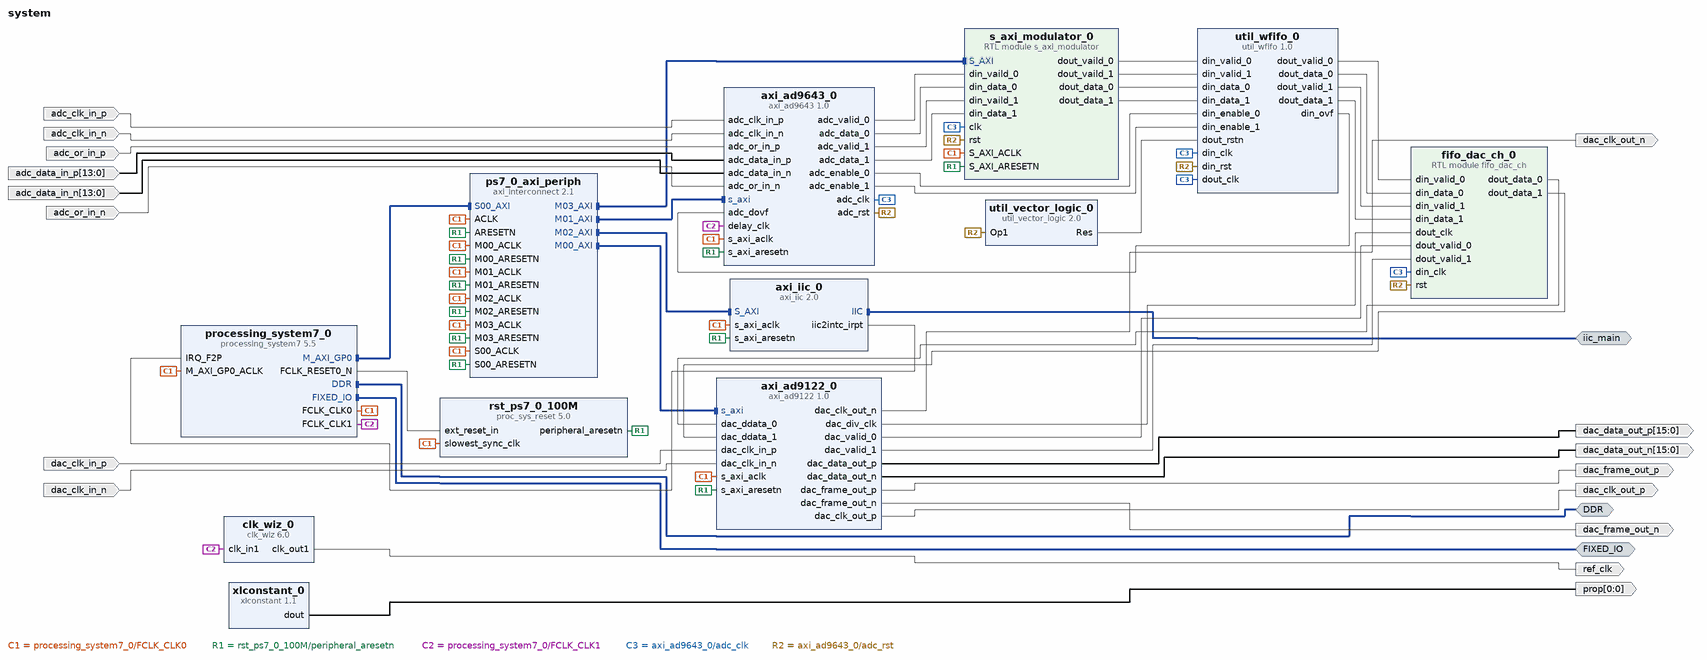
[diagram p0: block diagram of the top level]
# Vivado block design system, xc7z045ffg900-2, Vivado 2019.1
create_bd_design system

create_bd_intf_port -mode Master -vlnv xilinx.com:interface:ddrx_rtl:1.0 DDR
create_bd_intf_port -mode Master -vlnv xilinx.com:display_processing_system7:fixedio_rtl:1.0 FIXED_IO
create_bd_intf_port -mode Master -vlnv xilinx.com:interface:iic_rtl:1.0 iic_main
create_bd_port -dir I adc_clk_in_p
create_bd_port -dir I adc_clk_in_n
create_bd_port -dir I adc_or_in_p
create_bd_port -dir I -from 13 -to 0 adc_data_in_p
create_bd_port -dir I -from 13 -to 0 adc_data_in_n
create_bd_port -dir I adc_or_in_n
create_bd_port -dir O dac_clk_out_n
create_bd_port -dir O -from 15 -to 0 dac_data_out_p
create_bd_port -dir I dac_clk_in_p
create_bd_port -dir O -from 15 -to 0 dac_data_out_n
create_bd_port -dir O dac_frame_out_p
create_bd_port -dir O dac_frame_out_n
create_bd_port -dir O dac_clk_out_p
create_bd_port -dir I dac_clk_in_n
create_bd_port -dir O -type clk ref_clk
set_property -dict {CONFIG.FREQ_HZ 30000000} [get_bd_ports ref_clk]
create_bd_port -dir O -from 0 -to 0 prop

create_bd_cell -type ip -vlnv analog.com:user:axi_ad9122:1.0 axi_ad9122_0
create_bd_cell -type ip -vlnv analog.com:user:axi_ad9643:1.0 axi_ad9643_0
create_bd_cell -type ip -vlnv analog.com:user:util_wfifo:1.0 util_wfifo_0
set_property -dict {CONFIG.DIN_ADDRESS_WIDTH 4 CONFIG.DIN_DATA_WIDTH 16 CONFIG.NUM_OF_CHANNELS 2} [get_bd_cells util_wfifo_0]
create_bd_cell -type ip -vlnv xilinx.com:ip:processing_system7:5.5 processing_system7_0
set_property -dict [list \
  CONFIG.PCW_APU_PERIPHERAL_FREQMHZ 667.000000 \
  CONFIG.PCW_DUAL_PARALLEL_QSPI_DATA_MODE x8 \
  CONFIG.PCW_ENET0_ENET0_IO {MIO 16 .. 27} \
  CONFIG.PCW_ENET0_GRP_MDIO_ENABLE 1 \
  CONFIG.PCW_ENET0_GRP_MDIO_IO {MIO 52 .. 53} \
  CONFIG.PCW_ENET0_PERIPHERAL_ENABLE 1 \
  CONFIG.PCW_ENET0_PERIPHERAL_FREQMHZ {100 Mbps} \
  CONFIG.PCW_ENET0_RESET_ENABLE 1 \
  CONFIG.PCW_ENET0_RESET_IO {MIO 47} \
  CONFIG.PCW_ENET_RESET_ENABLE 1 \
  CONFIG.PCW_ENET_RESET_SELECT {Share reset pin} \
  CONFIG.PCW_EN_CLK1_PORT 1 \
  CONFIG.PCW_FCLK_CLK1_BUF TRUE \
  CONFIG.PCW_FPGA0_PERIPHERAL_FREQMHZ 100 \
  CONFIG.PCW_FPGA1_PERIPHERAL_FREQMHZ 200 \
  CONFIG.PCW_FPGA_FCLK1_ENABLE 1 \
  CONFIG.PCW_GPIO_MIO_GPIO_ENABLE 1 \
  CONFIG.PCW_GPIO_MIO_GPIO_IO MIO \
  CONFIG.PCW_I2C0_GRP_INT_ENABLE 0 \
  CONFIG.PCW_I2C0_I2C0_IO {MIO 50 .. 51} \
  CONFIG.PCW_I2C0_PERIPHERAL_ENABLE 1 \
  CONFIG.PCW_I2C0_RESET_ENABLE 1 \
  CONFIG.PCW_I2C0_RESET_IO {MIO 46} \
  CONFIG.PCW_I2C_PERIPHERAL_FREQMHZ 111.111115 \
  CONFIG.PCW_I2C_RESET_ENABLE 1 \
  CONFIG.PCW_I2C_RESET_SELECT {Share reset pin} \
  CONFIG.PCW_IRQ_F2P_INTR 1 \
  CONFIG.PCW_PRESET_BANK0_VOLTAGE {LVCMOS 1.8V} \
  CONFIG.PCW_PRESET_BANK1_VOLTAGE {LVCMOS 1.8V} \
  CONFIG.PCW_QSPI_GRP_FBCLK_ENABLE 1 \
  CONFIG.PCW_QSPI_GRP_FBCLK_IO {MIO 8} \
  CONFIG.PCW_QSPI_GRP_IO1_ENABLE 1 \
  CONFIG.PCW_QSPI_GRP_IO1_IO {MIO 0 9 .. 13} \
  CONFIG.PCW_QSPI_GRP_SINGLE_SS_ENABLE 0 \
  CONFIG.PCW_QSPI_INTERNAL_HIGHADDRESS 0xFDFFFFFF \
  CONFIG.PCW_QSPI_PERIPHERAL_ENABLE 1 \
  CONFIG.PCW_QSPI_QSPI_IO {MIO 1 .. 6} \
  CONFIG.PCW_SD0_GRP_CD_ENABLE 1 \
  CONFIG.PCW_SD0_GRP_CD_IO {MIO 14} \
  CONFIG.PCW_SD0_GRP_WP_ENABLE 1 \
  CONFIG.PCW_SD0_GRP_WP_IO {MIO 15} \
  CONFIG.PCW_SD0_PERIPHERAL_ENABLE 1 \
  CONFIG.PCW_SD0_SD0_IO {MIO 40 .. 45} \
  CONFIG.PCW_SDIO_PERIPHERAL_FREQMHZ 50 \
  CONFIG.PCW_UART1_PERIPHERAL_ENABLE 1 \
  CONFIG.PCW_UART1_UART1_IO {MIO 48 .. 49} \
  CONFIG.PCW_UART_PERIPHERAL_FREQMHZ 50 \
  CONFIG.PCW_UIPARAM_DDR_FREQ_MHZ 533.333313 \
  CONFIG.PCW_UIPARAM_DDR_PARTNO Custom \
  CONFIG.PCW_USB0_PERIPHERAL_ENABLE 0 \
  CONFIG.PCW_USB_RESET_ENABLE 1 \
  CONFIG.PCW_USE_FABRIC_INTERRUPT 1 \
  CONFIG.preset ZC706 \
] [get_bd_cells processing_system7_0]
# 234 more settings of processing_system7_0 are not shown: defaults, MIO pin electricals, DDR timing, and values the tool derives
create_bd_cell -type ip -vlnv xilinx.com:ip:axi_iic:2.0 axi_iic_0
create_bd_cell -type ip -vlnv xilinx.com:ip:clk_wiz:6.0 clk_wiz_0
set_property -dict [list \
  CONFIG.CLKOUT1_DRIVES BUFG \
  CONFIG.CLKOUT1_JITTER 134.641 \
  CONFIG.CLKOUT1_PHASE_ERROR 82.655 \
  CONFIG.CLKOUT1_REQUESTED_OUT_FREQ 30.000 \
  CONFIG.CLKOUT2_DRIVES BUFG \
  CONFIG.CLKOUT3_DRIVES BUFG \
  CONFIG.CLKOUT4_DRIVES BUFG \
  CONFIG.CLKOUT5_DRIVES BUFG \
  CONFIG.CLKOUT6_DRIVES BUFG \
  CONFIG.CLKOUT7_DRIVES BUFG \
  CONFIG.JITTER_SEL Min_O_Jitter \
  CONFIG.MMCM_BANDWIDTH HIGH \
  CONFIG.MMCM_CLKFBOUT_MULT_F 6.000 \
  CONFIG.MMCM_CLKOUT0_DIVIDE_F 40.000 \
  CONFIG.SECONDARY_SOURCE Single_ended_clock_capable_pin \
  CONFIG.USE_LOCKED false \
  CONFIG.USE_PHASE_ALIGNMENT false \
  CONFIG.USE_RESET false \
] [get_bd_cells clk_wiz_0]
create_bd_cell -type ip -vlnv xilinx.com:ip:axi_interconnect:2.1 ps7_0_axi_periph
set_property -dict {CONFIG.NUM_MI 4} [get_bd_cells ps7_0_axi_periph]
create_bd_cell -type ip -vlnv xilinx.com:ip:proc_sys_reset:5.0 rst_ps7_0_100M
create_bd_cell -type module -reference fifo_dac_ch fifo_dac_ch_0
set_property -dict {CONFIG.DD 1024 CONFIG.WW 64} [get_bd_cells fifo_dac_ch_0]
create_bd_cell -type module -reference s_axi_modulator s_axi_modulator_0
create_bd_cell -type ip -vlnv xilinx.com:ip:xlconstant:1.1 xlconstant_0
create_bd_cell -type ip -vlnv xilinx.com:ip:util_vector_logic:2.0 util_vector_logic_0
set_property -dict {CONFIG.C_OPERATION not CONFIG.C_SIZE 1} [get_bd_cells util_vector_logic_0]

# ---- connections ----

connect_bd_intf_net [get_bd_intf_ports DDR] [get_bd_intf_pins processing_system7_0/DDR]
connect_bd_intf_net [get_bd_intf_pins ps7_0_axi_periph/M02_AXI] [get_bd_intf_pins axi_iic_0/S_AXI]
connect_bd_intf_net [get_bd_intf_ports FIXED_IO] [get_bd_intf_pins processing_system7_0/FIXED_IO]
connect_bd_intf_net [get_bd_intf_pins ps7_0_axi_periph/M00_AXI] [get_bd_intf_pins axi_ad9122_0/s_axi]
connect_bd_intf_net [get_bd_intf_pins ps7_0_axi_periph/M03_AXI] [get_bd_intf_pins s_axi_modulator_0/S_AXI]
connect_bd_intf_net [get_bd_intf_pins processing_system7_0/M_AXI_GP0] [get_bd_intf_pins ps7_0_axi_periph/S00_AXI]
connect_bd_intf_net [get_bd_intf_pins ps7_0_axi_periph/M01_AXI] [get_bd_intf_pins axi_ad9643_0/s_axi]
connect_bd_intf_net [get_bd_intf_ports iic_main] [get_bd_intf_pins axi_iic_0/IIC]
connect_bd_net -net adc_clk_in_p_0_1 [get_bd_ports adc_clk_in_p] [get_bd_pins axi_ad9643_0/adc_clk_in_p]
connect_bd_net -net adc_clk_in_n_0_1 [get_bd_ports adc_clk_in_n] [get_bd_pins axi_ad9643_0/adc_clk_in_n]
connect_bd_net -net adc_or_in_p_0_1 [get_bd_ports adc_or_in_p] [get_bd_pins axi_ad9643_0/adc_or_in_p]
connect_bd_net -net adc_data_in_p_0_1 [get_bd_ports adc_data_in_p] [get_bd_pins axi_ad9643_0/adc_data_in_p]
connect_bd_net -net adc_data_in_n_0_1 [get_bd_ports adc_data_in_n] [get_bd_pins axi_ad9643_0/adc_data_in_n]
connect_bd_net -net adc_or_in_n_0_1 [get_bd_ports adc_or_in_n] [get_bd_pins axi_ad9643_0/adc_or_in_n]
connect_bd_net [get_bd_pins axi_ad9122_0/dac_clk_out_n] [get_bd_ports dac_clk_out_n]
connect_bd_net [get_bd_pins axi_ad9122_0/dac_data_out_p] [get_bd_ports dac_data_out_p]
connect_bd_net -net dac_clk_in_p_0_1 [get_bd_ports dac_clk_in_p] [get_bd_pins axi_ad9122_0/dac_clk_in_p]
connect_bd_net [get_bd_pins axi_ad9122_0/dac_data_out_n] [get_bd_ports dac_data_out_n]
connect_bd_net [get_bd_pins axi_ad9122_0/dac_frame_out_p] [get_bd_ports dac_frame_out_p]
connect_bd_net [get_bd_pins axi_ad9122_0/dac_frame_out_n] [get_bd_ports dac_frame_out_n]
connect_bd_net [get_bd_pins axi_ad9122_0/dac_clk_out_p] [get_bd_ports dac_clk_out_p]
connect_bd_net -net dac_clk_in_n_0_1 [get_bd_ports dac_clk_in_n] [get_bd_pins axi_ad9122_0/dac_clk_in_n]
connect_bd_net [get_bd_pins processing_system7_0/FCLK_CLK0] \
  [get_bd_pins processing_system7_0/M_AXI_GP0_ACLK] [get_bd_pins ps7_0_axi_periph/S00_ACLK] \
  [get_bd_pins rst_ps7_0_100M/slowest_sync_clk] [get_bd_pins axi_ad9122_0/s_axi_aclk] [get_bd_pins ps7_0_axi_periph/M00_ACLK] \
  [get_bd_pins ps7_0_axi_periph/ACLK] [get_bd_pins axi_ad9643_0/s_axi_aclk] [get_bd_pins ps7_0_axi_periph/M01_ACLK] \
  [get_bd_pins axi_iic_0/s_axi_aclk] [get_bd_pins ps7_0_axi_periph/M02_ACLK] [get_bd_pins s_axi_modulator_0/S_AXI_ACLK] \
  [get_bd_pins ps7_0_axi_periph/M03_ACLK]
connect_bd_net [get_bd_pins processing_system7_0/FCLK_RESET0_N] [get_bd_pins rst_ps7_0_100M/ext_reset_in]
connect_bd_net [get_bd_pins rst_ps7_0_100M/peripheral_aresetn] \
  [get_bd_pins ps7_0_axi_periph/S00_ARESETN] [get_bd_pins axi_ad9122_0/s_axi_aresetn] \
  [get_bd_pins ps7_0_axi_periph/M00_ARESETN] [get_bd_pins ps7_0_axi_periph/ARESETN] [get_bd_pins axi_ad9643_0/s_axi_aresetn] \
  [get_bd_pins ps7_0_axi_periph/M01_ARESETN] [get_bd_pins axi_iic_0/s_axi_aresetn] [get_bd_pins ps7_0_axi_periph/M02_ARESETN] \
  [get_bd_pins s_axi_modulator_0/S_AXI_ARESETN] [get_bd_pins ps7_0_axi_periph/M03_ARESETN]
connect_bd_net [get_bd_pins processing_system7_0/FCLK_CLK1] [get_bd_pins axi_ad9643_0/delay_clk] [get_bd_pins clk_wiz_0/clk_in1]
connect_bd_net [get_bd_pins axi_ad9643_0/adc_clk] \
  [get_bd_pins fifo_dac_ch_0/din_clk] [get_bd_pins util_wfifo_0/din_clk] [get_bd_pins util_wfifo_0/dout_clk] \
  [get_bd_pins s_axi_modulator_0/clk]
connect_bd_net [get_bd_pins axi_ad9122_0/dac_div_clk] [get_bd_pins fifo_dac_ch_0/dout_clk]
connect_bd_net [get_bd_pins clk_wiz_0/clk_out1] [get_bd_ports ref_clk]
connect_bd_net [get_bd_pins axi_iic_0/iic2intc_irpt] [get_bd_pins processing_system7_0/IRQ_F2P]
connect_bd_net [get_bd_pins util_wfifo_0/dout_valid_0] [get_bd_pins fifo_dac_ch_0/din_valid_0]
connect_bd_net [get_bd_pins util_wfifo_0/dout_data_0] [get_bd_pins fifo_dac_ch_0/din_data_0]
connect_bd_net [get_bd_pins util_wfifo_0/dout_valid_1] [get_bd_pins fifo_dac_ch_0/din_valid_1]
connect_bd_net [get_bd_pins util_wfifo_0/dout_data_1] [get_bd_pins fifo_dac_ch_0/din_data_1]
connect_bd_net [get_bd_pins axi_ad9643_0/adc_rst] \
  [get_bd_pins fifo_dac_ch_0/rst] [get_bd_pins util_wfifo_0/din_rst] [get_bd_pins s_axi_modulator_0/rst] \
  [get_bd_pins util_vector_logic_0/Op1]
connect_bd_net [get_bd_pins util_wfifo_0/din_ovf] [get_bd_pins axi_ad9643_0/adc_dovf]
connect_bd_net [get_bd_pins fifo_dac_ch_0/dout_data_0] [get_bd_pins axi_ad9122_0/dac_ddata_0]
connect_bd_net [get_bd_pins fifo_dac_ch_0/dout_data_1] [get_bd_pins axi_ad9122_0/dac_ddata_1]
connect_bd_net [get_bd_pins axi_ad9122_0/dac_valid_0] [get_bd_pins fifo_dac_ch_0/dout_valid_0]
connect_bd_net [get_bd_pins axi_ad9122_0/dac_valid_1] [get_bd_pins fifo_dac_ch_0/dout_valid_1]
connect_bd_net [get_bd_pins axi_ad9643_0/adc_valid_0] [get_bd_pins s_axi_modulator_0/din_vaild_0]
connect_bd_net [get_bd_pins axi_ad9643_0/adc_data_0] [get_bd_pins s_axi_modulator_0/din_data_0]
connect_bd_net [get_bd_pins axi_ad9643_0/adc_valid_1] [get_bd_pins s_axi_modulator_0/din_vaild_1]
connect_bd_net [get_bd_pins axi_ad9643_0/adc_data_1] [get_bd_pins s_axi_modulator_0/din_data_1]
connect_bd_net [get_bd_pins s_axi_modulator_0/dout_vaild_0] [get_bd_pins util_wfifo_0/din_valid_0]
connect_bd_net [get_bd_pins s_axi_modulator_0/dout_vaild_1] [get_bd_pins util_wfifo_0/din_valid_1]
connect_bd_net [get_bd_pins s_axi_modulator_0/dout_data_0] [get_bd_pins util_wfifo_0/din_data_0]
connect_bd_net [get_bd_pins s_axi_modulator_0/dout_data_1] [get_bd_pins util_wfifo_0/din_data_1]
connect_bd_net [get_bd_pins axi_ad9643_0/adc_enable_0] [get_bd_pins util_wfifo_0/din_enable_0]
connect_bd_net [get_bd_pins axi_ad9643_0/adc_enable_1] [get_bd_pins util_wfifo_0/din_enable_1]
connect_bd_net [get_bd_pins xlconstant_0/dout] [get_bd_ports prop]
connect_bd_net [get_bd_pins util_vector_logic_0/Res] [get_bd_pins util_wfifo_0/dout_rstn]

# ---- address map ----
assign_bd_address -offset 0x41600000 -range 64K -target_address_space [get_bd_addr_spaces processing_system7_0/Data] [get_bd_addr_segs axi_iic_0/S_AXI/Reg]
assign_bd_address -offset 0x43C00000 -range 64K -target_address_space [get_bd_addr_spaces processing_system7_0/Data] [get_bd_addr_segs axi_ad9122_0/s_axi/axi_lite]
assign_bd_address -offset 0x43C10000 -range 64K -target_address_space [get_bd_addr_spaces processing_system7_0/Data] [get_bd_addr_segs axi_ad9643_0/s_axi/axi_lite]
assign_bd_address -offset 0x43C20000 -range 64K -target_address_space [get_bd_addr_spaces processing_system7_0/Data] [get_bd_addr_segs s_axi_modulator_0/S_AXI/reg0]

validate_bd_design
save_bd_design
